# EAGLE schematic Central Board (EAGLE 8.5.1)

## Sheet 1 of 2
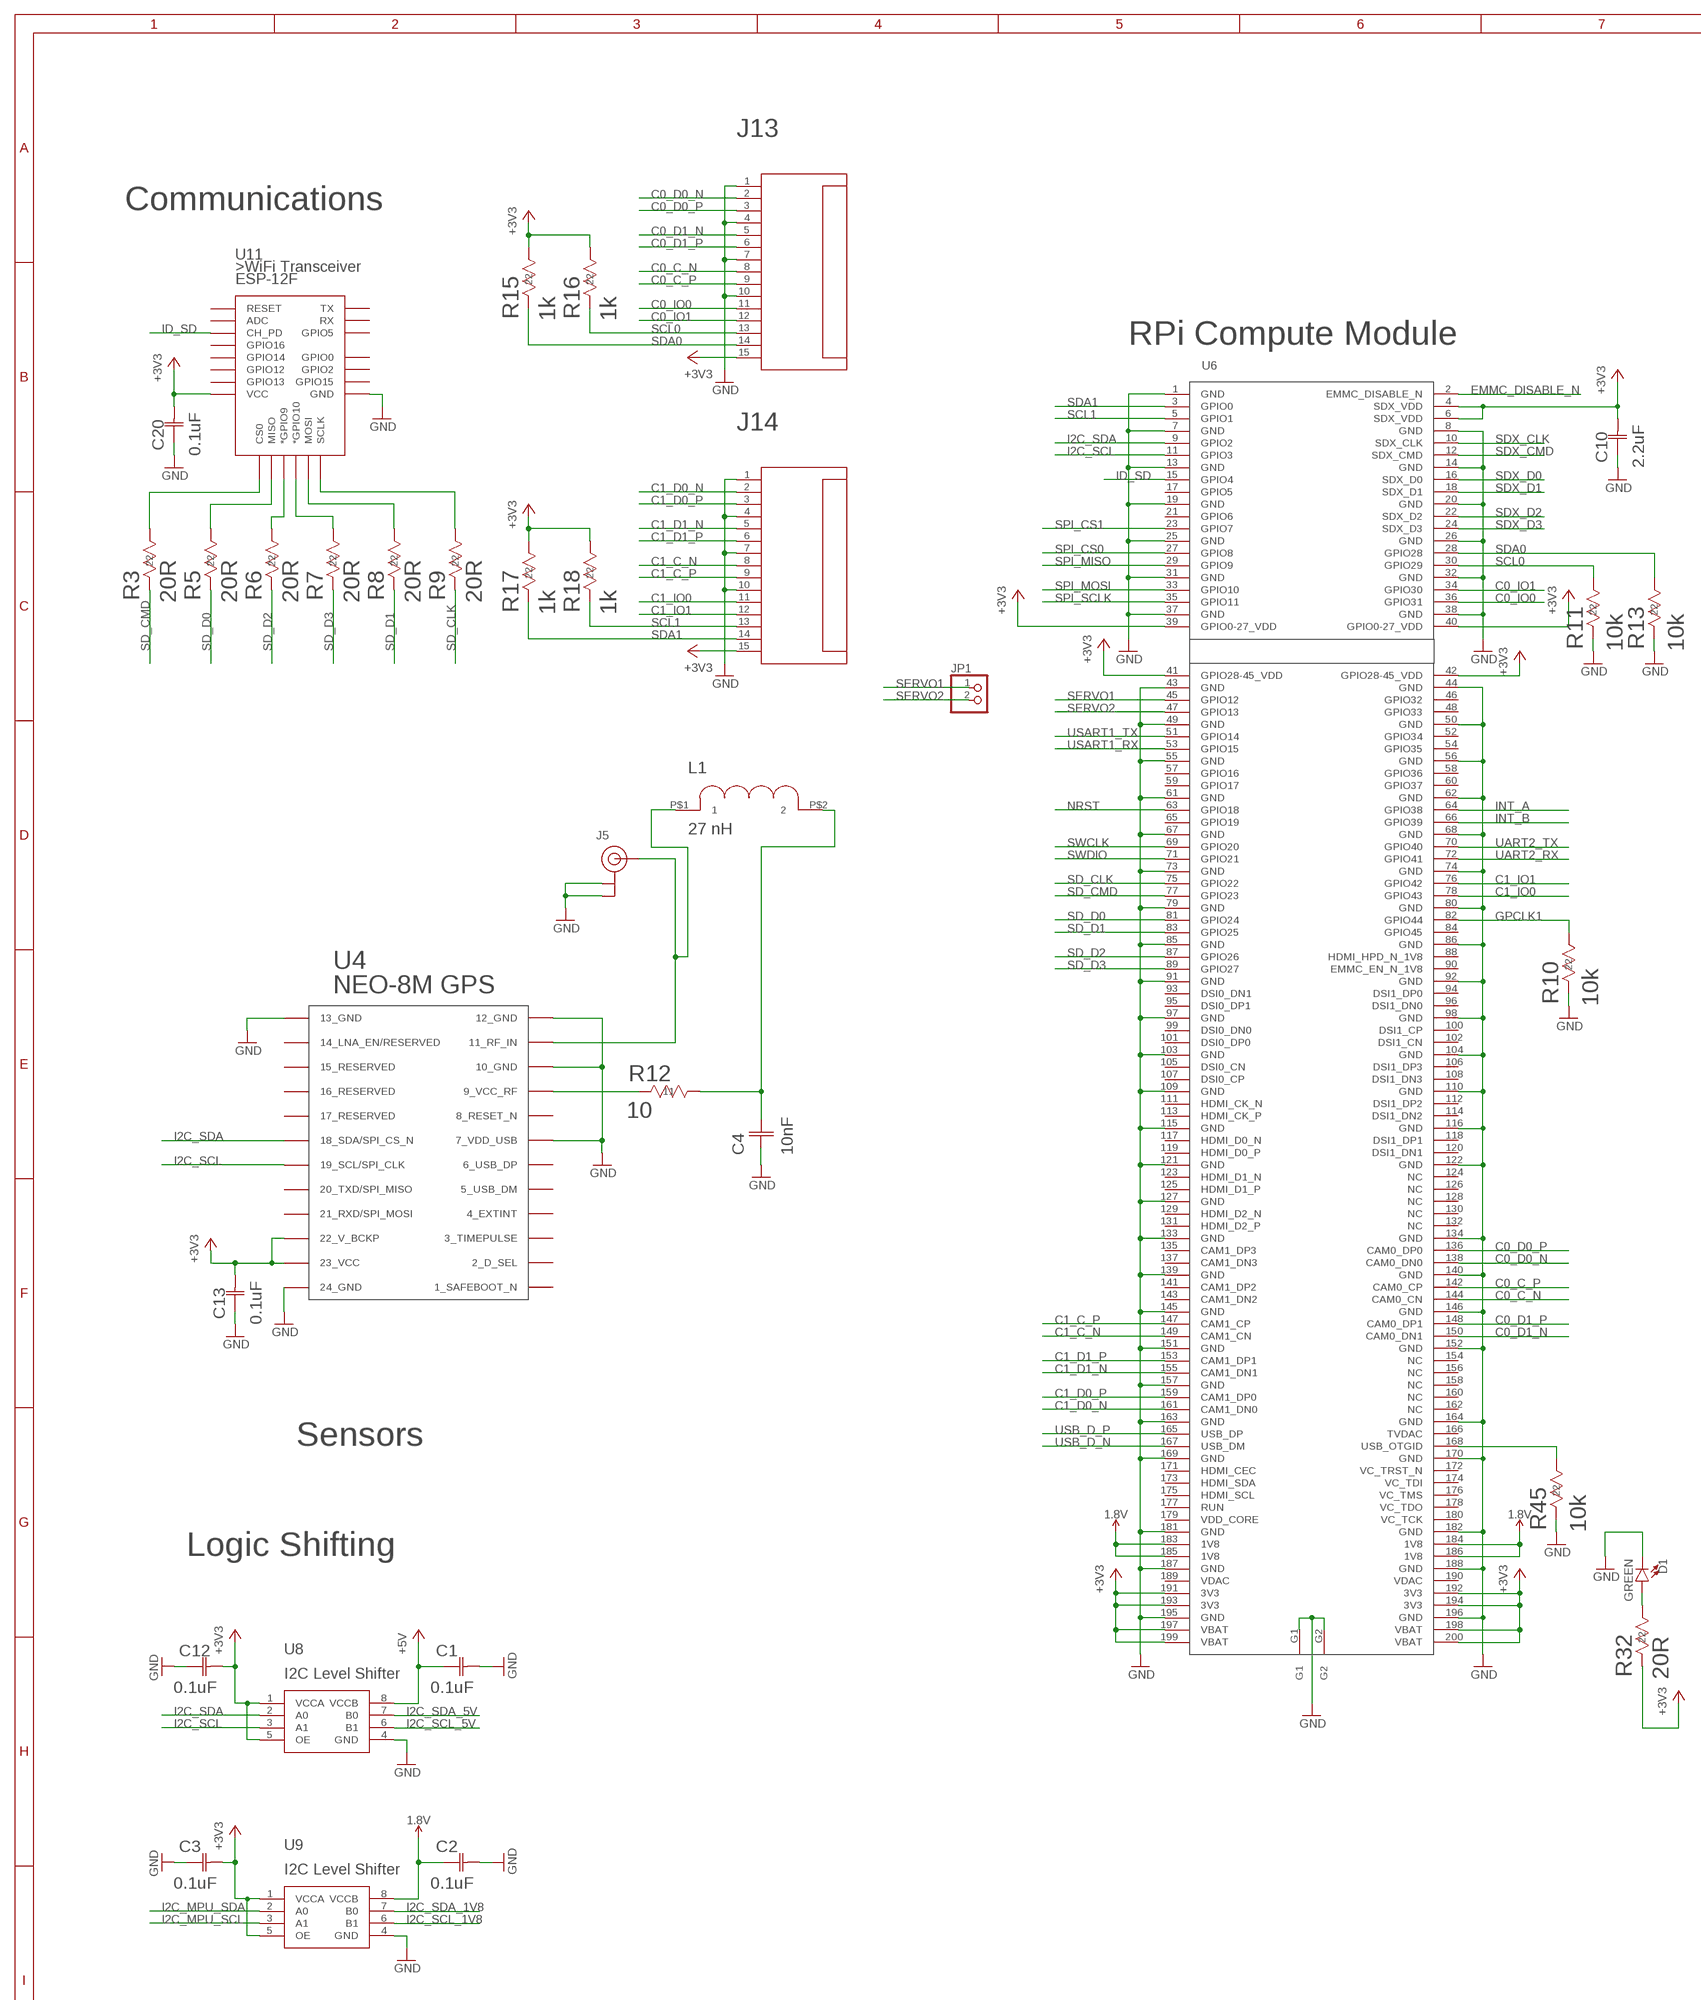
[diagram p0: schematic, sheet 1, part 1 of 2]
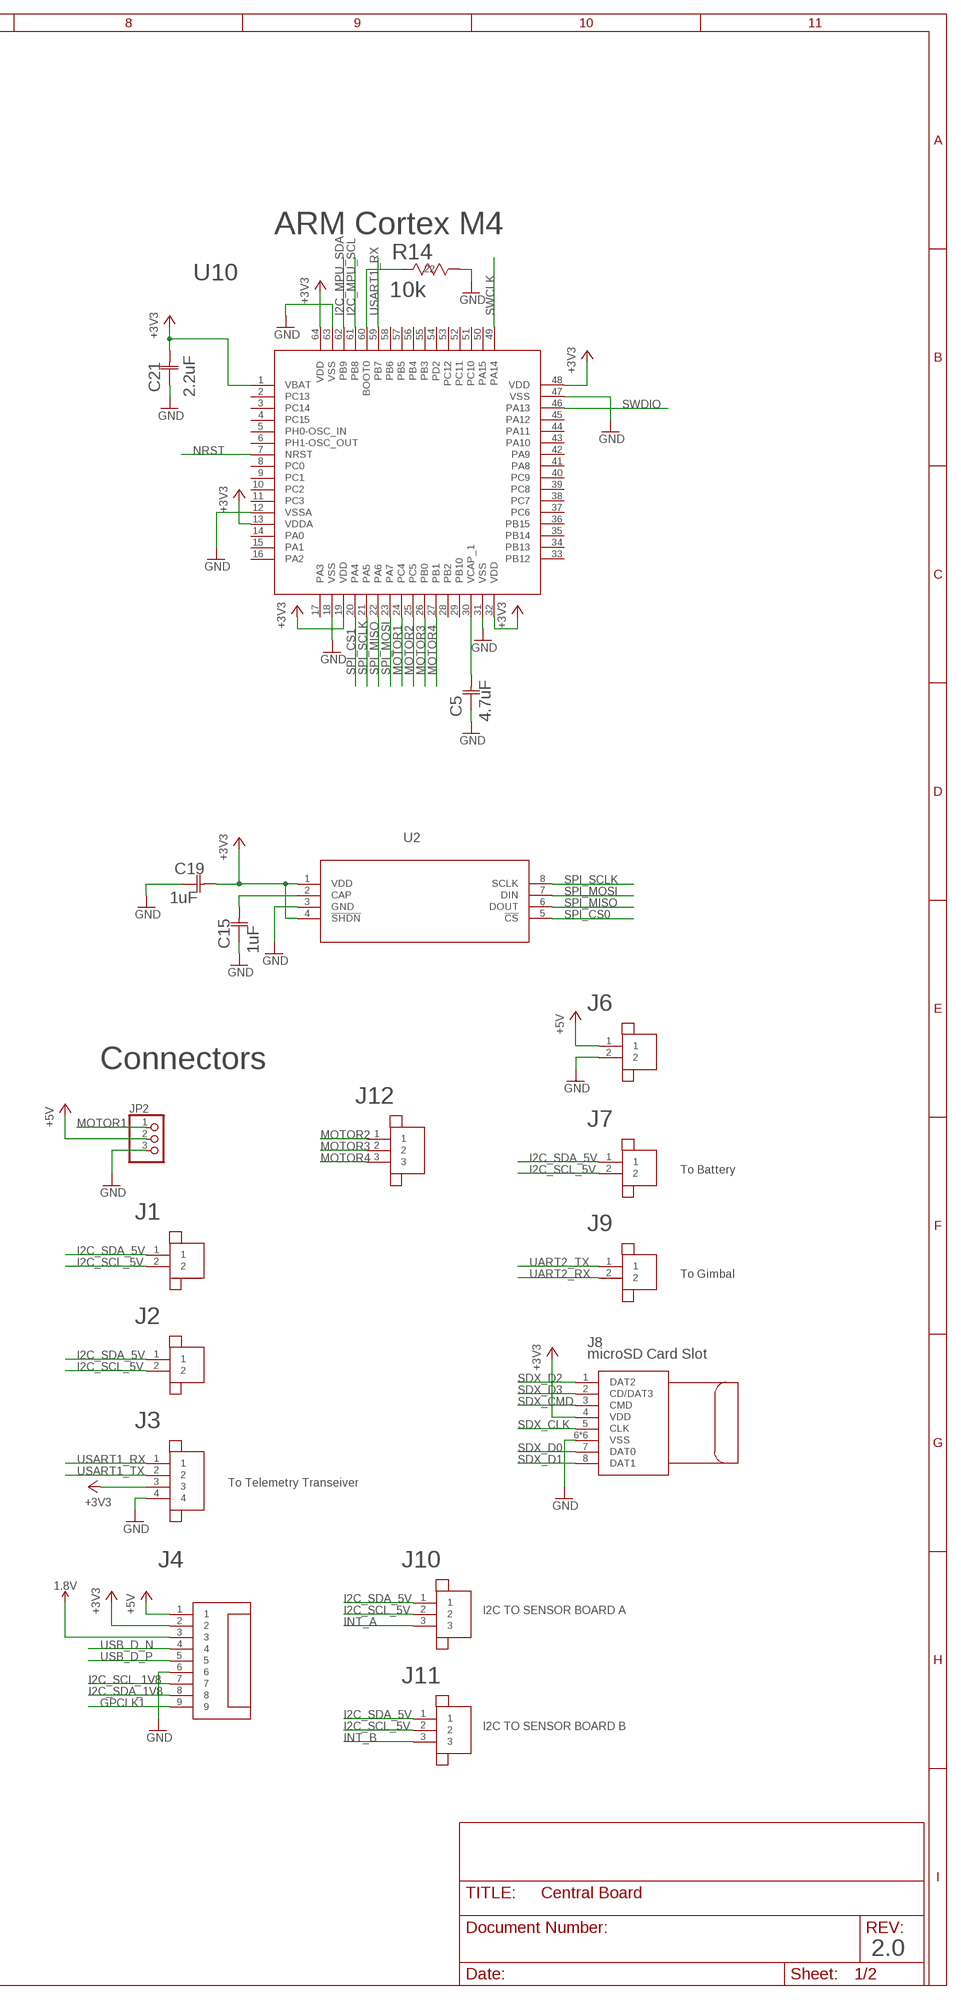
[diagram p1: schematic, sheet 1, part 2 of 2]

### Parts
C1  0.1uF  08055C104KAT2A  [0805]
C2  0.1uF  08055C104KAT2A  [0805]
C3  0.1uF  08055C104KAT2A  [0805]
C4  10nF  10NF_CAPACITOR  [0603_CAPACITOR]
C5  4.7uF  06036D475KAT2A0603-M  [0603-M]
C10  2.2uF  GRM188R61C225KE15JG-188-M  [G-188-M]
C12  0.1uF  08055C104KAT2A  [0805]
C13  0.1uF  08055C104KAT2A  [0805]
C15  1uF  CC0805KKX7R7BB105  [YAG_CC0805]
C19  1uF  CC0805KKX7R7BB105  [YAG_CC0805]
C20  0.1uF  08055C104KAT2A  [0805]
C21  2.2uF  GRM188R61C225KE15JG-188-M  [G-188-M]
D1  GREEN  LED-GREEN0603  [LED-0603]
J1  JST_SH_2POS  [JST_SH_2POS]
J2  JST_SH_2POS  [JST_SH_2POS]
J3  JST_SH_4POS  [JST_SH_4POS]
J4  9POS_FFC_CONNECTOR  [9POS_FFC_CONNECTOR]
J5  U.FL  [U.FL]
J6  JST_SH_2POS  [JST_SH_2POS]
J7  JST_SH_2POS  [JST_SH_2POS]
J8  MICROSD  [MICROSD]
J9  JST_SH_2POS  [JST_SH_2POS]
J10  JST_SH_3POS  [JST_SH_3POS]
J11  JST_SH_3POS  [JST_SH_3POS]
J12  JST_SH_3POS  [JST_SH_3POS]
J13  0526101572_15ZIF_CONNECTOR  [15POS_FFC_CONNECTOR]
J14  0526101572_15ZIF_CONNECTOR  [15POS_FFC_CONNECTOR]
JP1  PINHD-1X2  [1X02]
JP2  PINHD-1X3  [1X03]
L1  27 nH  27NH_INDUCTOR  [0402_INDUCTOR]
R3  20R  RC0603JR-0720RLRC0603N-M  [RC0603N-M]
R5  20R  RC0603JR-0720RLRC0603N-M  [RC0603N-M]
R6  20R  RC0603JR-0720RLRC0603N-M  [RC0603N-M]
R7  20R  RC0603JR-0720RLRC0603N-M  [RC0603N-M]
R8  20R  RC0603JR-0720RLRC0603N-M  [RC0603N-M]
R9  20R  RC0603JR-0720RLRC0603N-M  [RC0603N-M]
R10  10k  ERA-6AEB103V  [RC0805N]
R11  10k  ERA-6AEB103V  [RC0805N]
R12  10  RNCP0805FTD10R0STA_RNCP0805-M  [STA_RNCP0805-M]
R13  10k  ERA-6AEB103V  [RC0805N]
R14  10k  ERA-6AEB103V  [RC0805N]
R15  1k  RC0603JR-071KLRC0603N-M  [RC0603N-M]
R16  1k  RC0603JR-071KLRC0603N-M  [RC0603N-M]
R17  1k  RC0603JR-071KLRC0603N-M  [RC0603N-M]
R18  1k  RC0603JR-071KLRC0603N-M  [RC0603N-M]
R32  20R  RC0603JR-0720RLRC0603N-M  [RC0603N-M]
R45  10k  ERA-6AEB103V  [RC0805N]
U2  MPL115A1LGA8-M  [LGA8-M]
U4  NEO-M8  [NEO-M8]
U6  COMPUTE_MODULE  [SO-DIMM]
U8  FXMAR2102  [8-UMLP]
U9  FXMAR2102  [8-UMLP]
U10  STM32F446  [LQFP64]
U11  ESP12ESMD  [ESP12E-SMD]

### Nets
1.8V: C2.1 J4.3 U6.183(1V8) U6.184(1V8) U6.185(1V8) U6.186(1V8) U9.8(VCCB) ; also sheet 2
+3V3: C3.2 C10.2 C12.2 C13.2 C19.2 C20.2 C21.2 J3.3 J4.2 J8.4(VDD) J13.15 J14.15 R15.1 R16.1 R17.1 R18.1 R32.2 U2.1(VDD) U2.4(!SHDN) U4.22(22_V_BCKP) U4.23(23_VCC) U6.4(SDX_VDD) U6.6(SDX_VDD) U6.39(GPIO0-27_VDD) U6.40(GPIO0-27_VDD) U6.41(GPIO28-45_VDD) U6.42(GPIO28-45_VDD) U6.191(3V3) U6.192(3V3) U6.193(3V3) U6.194(3V3) U6.197(VBAT) U6.198(VBAT) U6.199(VBAT) U6.200(VBAT) U8.1(VCCA) U8.5(OE) U9.1(VCCA) U9.5(OE) U10.1(VBAT) U10.13(VDDA) U10.19(VDD) U10.32(VDD) U10.48(VDD) U10.64(VDD) U11.VCC ; also sheet 2
+5V: C1.1 J4.1 J6.1 JP2.2 U8.8(VCCB) ; also sheet 2
C0_C_N: J13.8 U6.144(CAM0_CN)
C0_C_P: J13.9 U6.142(CAM0_CP)
C0_D0_N: J13.2 U6.138(CAM0_DN0)
C0_D0_P: J13.3 U6.136(CAM0_DP0)
C0_D1_N: J13.5 U6.150(CAM0_DN1)
C0_D1_P: J13.6 U6.148(CAM0_DP1)
C0_IO0: J13.11 U6.36(GPIO31)
C0_IO1: J13.12 U6.34(GPIO30)
C1_C_N: J14.8 U6.149(CAM1_CN)
C1_C_P: J14.9 U6.147(CAM1_CP)
C1_D0_N: J14.2 U6.161(CAM1_DN0)
C1_D0_P: J14.3 U6.159(CAM1_DP0)
C1_D1_N: J14.5 U6.155(CAM1_DN1)
C1_D1_P: J14.6 U6.153(CAM1_DP1)
C1_IO0: J14.11 U6.78(GPIO43)
C1_IO1: J14.12 U6.76(GPIO42)
EMMC_DISABLE_N: U6.2(EMMC_DISABLE_N)
GND: C1.2 C2.2 C3.1 C4.1 C5.1 C10.1 C12.1 C13.1 C15.1 C19.1 C20.1 C21.1 D1.C J3.4 J4.6 J5.P$1(GND) J5.P$2(GND) J6.2 J8.6(VSS) J8.9(VSS) J8.10(VSS) J8.11(VSS) J8.12(VSS) J8.13(VSS) J13.1 J13.4 J13.7 J13.10 J14.1 J14.4 J14.7 J14.10 JP2.3 R10.2 R11.2 R13.2 R14.1 R45.2 U2.3(GND) U4.7(7_VDD_USB) U4.10(10_GND) U4.12(12_GND) U4.13(13_GND) U4.24(24_GND) U6.1(GND) U6.7(GND) U6.8(GND) U6.13(GND) U6.14(GND) U6.19(GND) U6.20(GND) U6.25(GND) U6.26(GND) U6.31(GND) U6.32(GND) U6.37(GND) U6.38(GND) U6.43(GND) U6.44(GND) U6.49(GND) U6.50(GND) U6.55(GND) U6.56(GND) U6.61(GND) U6.62(GND) U6.67(GND) U6.68(GND) U6.73(GND) U6.74(GND) U6.79(GND) U6.80(GND) U6.85(GND) U6.86(GND) U6.91(GND) U6.92(GND) U6.97(GND) U6.98(GND) U6.103(GND) U6.104(GND) U6.109(GND) U6.110(GND) U6.115(GND) U6.116(GND) U6.121(GND) U6.122(GND) U6.127(GND) U6.133(GND) U6.134(GND) U6.139(GND) U6.140(GND) U6.145(GND) U6.146(GND) U6.151(GND) U6.152(GND) U6.157(GND) U6.163(GND) U6.164(GND) U6.169(GND) U6.170(GND) U6.181(GND) U6.182(GND) U6.187(GND) U6.188(GND) U6.195(GND) U6.196(GND) U6.G1 U6.G2 U8.4(GND) U9.4(GND) U10.12(VSSA) U10.18(VSS) U10.31(VSS) U10.47(VSS) U10.63(VSS) U11.GND ; also sheet 2
GPCLK1: J4.9 R10.1 U6.82(GPIO44)
I2C_MPU_SCL: U9.3(A1) U10.61(PB8)
I2C_MPU_SDA: U9.2(A0) U10.62(PB9)
I2C_SCL: U4.19(19_SCL/SPI_CLK) U6.11(GPIO3) U8.3(A1)
I2C_SCL_1V8: J4.7 U9.6(B1)
I2C_SCL_5V: J1.2 J2.2 J7.2 J10.2 J11.2 U8.6(B1)
I2C_SDA: U4.18(18_SDA/SPI_CS_N) U6.9(GPIO2) U8.2(A0)
I2C_SDA_1V8: J4.8 U9.7(B0)
I2C_SDA_5V: J1.1 J2.1 J7.1 J10.1 J11.1 U8.7(B0)
ID_SD: U6.15(GPIO4) U11.CH_PD
INT_A: J10.3 U6.64(GPIO38)
INT_B: J11.3 U6.66(GPIO39)
MOTOR1: JP2.1 U10.24(PC4)
MOTOR2: J12.1 U10.25(PC5)
MOTOR3: J12.2 U10.26(PB0)
MOTOR4: J12.3 U10.27(PB1)
N$1: J5.P$3(SIGNAL) L1.P$1 U4.11(11_RF_IN)
N$4: D1.A R32.1
N$7: R3.1 U11.CS0
N$8: R5.1 U11.MISO
N$9: R6.1 U11.GPIO9(*GPIO9)
N$10: R7.1 U11.GPIO10(*GPIO10)
N$11: C5.2 U10.30(VCAP_1)
N$12: C15.2 U2.2(CAP)
N$13: R12.1 U4.9(9_VCC_RF)
N$14: R8.1 U11.MOSI
N$15: R9.1 U11.SCLK
N$16: R14.2 U10.60(BOOT0)
N$26: C4.2 L1.P$2 R12.2
N$53: R45.1 U6.168(USB_OTGID)
NRST: U6.63(GPIO18) U10.7(NRST)
SCL0: J13.13 R11.1 R16.2 U6.30(GPIO29)
SCL1: J14.13 R18.2 U6.5(GPIO1)
SD_CLK: R9.2 U6.75(GPIO22)
SD_CMD: R3.2 U6.77(GPIO23)
SD_D0: R5.2 U6.81(GPIO24)
SD_D1: R8.2 U6.83(GPIO25)
SD_D2: R6.2 U6.87(GPIO26)
SD_D3: R7.2 U6.89(GPIO27)
SDA0: J13.14 R13.1 R15.2 U6.28(GPIO28)
SDA1: J14.14 R17.2 U6.3(GPIO0)
SDX_CLK: J8.5(CLK) U6.10(SDX_CLK)
SDX_CMD: J8.3(CMD) U6.12(SDX_CMD)
SDX_D0: J8.7(DAT0) U6.16(SDX_D0)
SDX_D1: J8.8(DAT1) U6.18(SDX_D1)
SDX_D2: J8.1(DAT2) U6.22(SDX_D2)
SDX_D3: J8.2(CD/DAT3) U6.24(SDX_D3)
SERVO1: JP1.1 U6.45(GPIO12)
SERVO2: JP1.2 U6.47(GPIO13)
SPI_CS0: U2.5(!CS) U6.27(GPIO8)
SPI_CS1: U6.23(GPIO7) U10.20(PA4)
SPI_MISO: U2.6(DOUT) U6.29(GPIO9) U10.22(PA6)
SPI_MOSI: U2.7(DIN) U6.33(GPIO10) U10.23(PA7)
SPI_SCLK: U2.8(SCLK) U6.35(GPIO11) U10.21(PA5)
SWCLK: U6.69(GPIO20) U10.49(PA14)
SWDIO: U6.71(GPIO21) U10.46(PA13)
UART2_RX: J9.2 U6.72(GPIO41)
UART2_TX: J9.1 U6.70(GPIO40)
USART1_RX: J3.1 U6.53(GPIO15) U10.59(PB7)
USART1_TX: J3.2 U6.51(GPIO14)
USB_D_N: J4.4 U6.167(USB_DM)
USB_D_P: J4.5 U6.165(USB_DP)
Unconnected: U4.1(1_SAFEBOOT_N) U4.2(2_D_SEL) U4.3(3_TIMEPULSE) U4.4(4_EXTINT) U4.5(5_USB_DM) U4.6(6_USB_DP) U4.8(8_RESET_N) U4.14(14_LNA_EN/RESERVED) U4.15(15_RESERVED) U4.16(16_RESERVED) U4.17(17_RESERVED) U4.20(20_TXD/SPI_MISO) U4.21(21_RXD/SPI_MOSI) U6.17(GPIO5) U6.21(GPIO6) U6.46(GPIO32) U6.48(GPIO33) U6.52(GPIO34) U6.54(GPIO35) U6.57(GPIO16) U6.58(GPIO36) U6.59(GPIO17) U6.60(GPIO37) U6.65(GPIO19) U6.84(GPIO45) U6.88(HDMI_HPD_N_1V8) U6.90(EMMC_EN_N_1V8) U6.93(DSI0_DN1) U6.94(DSI1_DP0) U6.95(DSI0_DP1) U6.96(DSI1_DN0) U6.99(DSI0_DN0) U6.100(DSI1_CP) U6.101(DSI0_DP0) U6.102(DSI1_CN) U6.105(DSI0_CN) U6.106(DSI1_DP3) U6.107(DSI0_CP) U6.108(DSI1_DN3) U6.111(HDMI_CK_N) U6.112(DSI1_DP2) U6.113(HDMI_CK_P) U6.114(DSI1_DN2) U6.117(HDMI_D0_N) U6.118(DSI1_DP1) U6.119(HDMI_D0_P) U6.120(DSI1_DN1) U6.123(HDMI_D1_N) U6.124(NC) U6.125(HDMI_D1_P) U6.126(NC) U6.128(NC) U6.129(HDMI_D2_N) U6.130(NC) U6.131(HDMI_D2_P) U6.132(NC) U6.135(CAM1_DP3) U6.137(CAM1_DN3) U6.141(CAM1_DP2) U6.143(CAM1_DN2) U6.154(NC) U6.156(NC) U6.158(NC) U6.160(NC) U6.162(NC) U6.166(TVDAC) U6.171(HDMI_CEC) U6.172(VC_TRST_N) U6.173(HDMI_SDA) U6.174(VC_TDI) U6.175(HDMI_SCL) U6.176(VC_TMS) U6.177(RUN) U6.178(VC_TDO) U6.179(VDD_CORE) U6.180(VC_TCK) U6.189(VDAC) U6.190(VDAC) U10.2(PC13) U10.3(PC14) U10.4(PC15) U10.5(PH0-OSC_IN) U10.6(PH1-OSC_OUT) U10.8(PC0) U10.9(PC1) U10.10(PC2) U10.11(PC3) U10.14(PA0) U10.15(PA1) U10.16(PA2) U10.17(PA3) U10.28(PB2) U10.29(PB10) U10.33(PB12) U10.34(PB13) U10.35(PB14) U10.36(PB15) U10.37(PC6) U10.38(PC7) U10.39(PC8) U10.40(PC9) U10.41(PA8) U10.42(PA9) U10.43(PA10) U10.44(PA11) U10.45(PA12) U10.50(PA15) U10.51(PC10) U10.52(PC11) U10.53(PC12) U10.54(PD2) U10.55(PB3) U10.56(PB4) U10.57(PB5) U10.58(PB6) U11.ADC U11.GPIO0 U11.GPIO2 U11.GPIO5 U11.GPIO12 U11.GPIO13 U11.GPIO14 U11.GPIO15 U11.GPIO16 U11.RESET U11.RXD0(RX) U11.TXD0(TX)

### Notes on the sheet
- Communications
- ARM Cortex M4
- RPi Compute Module
- Connectors
- To Battery
- To Gimbal
- Sensors
- Logic Shifting
- To Telemetry Transeiver
- I2C TO SENSOR BOARD A
- I2C TO SENSOR BOARD B
- 2.0

## Sheet 2 of 2
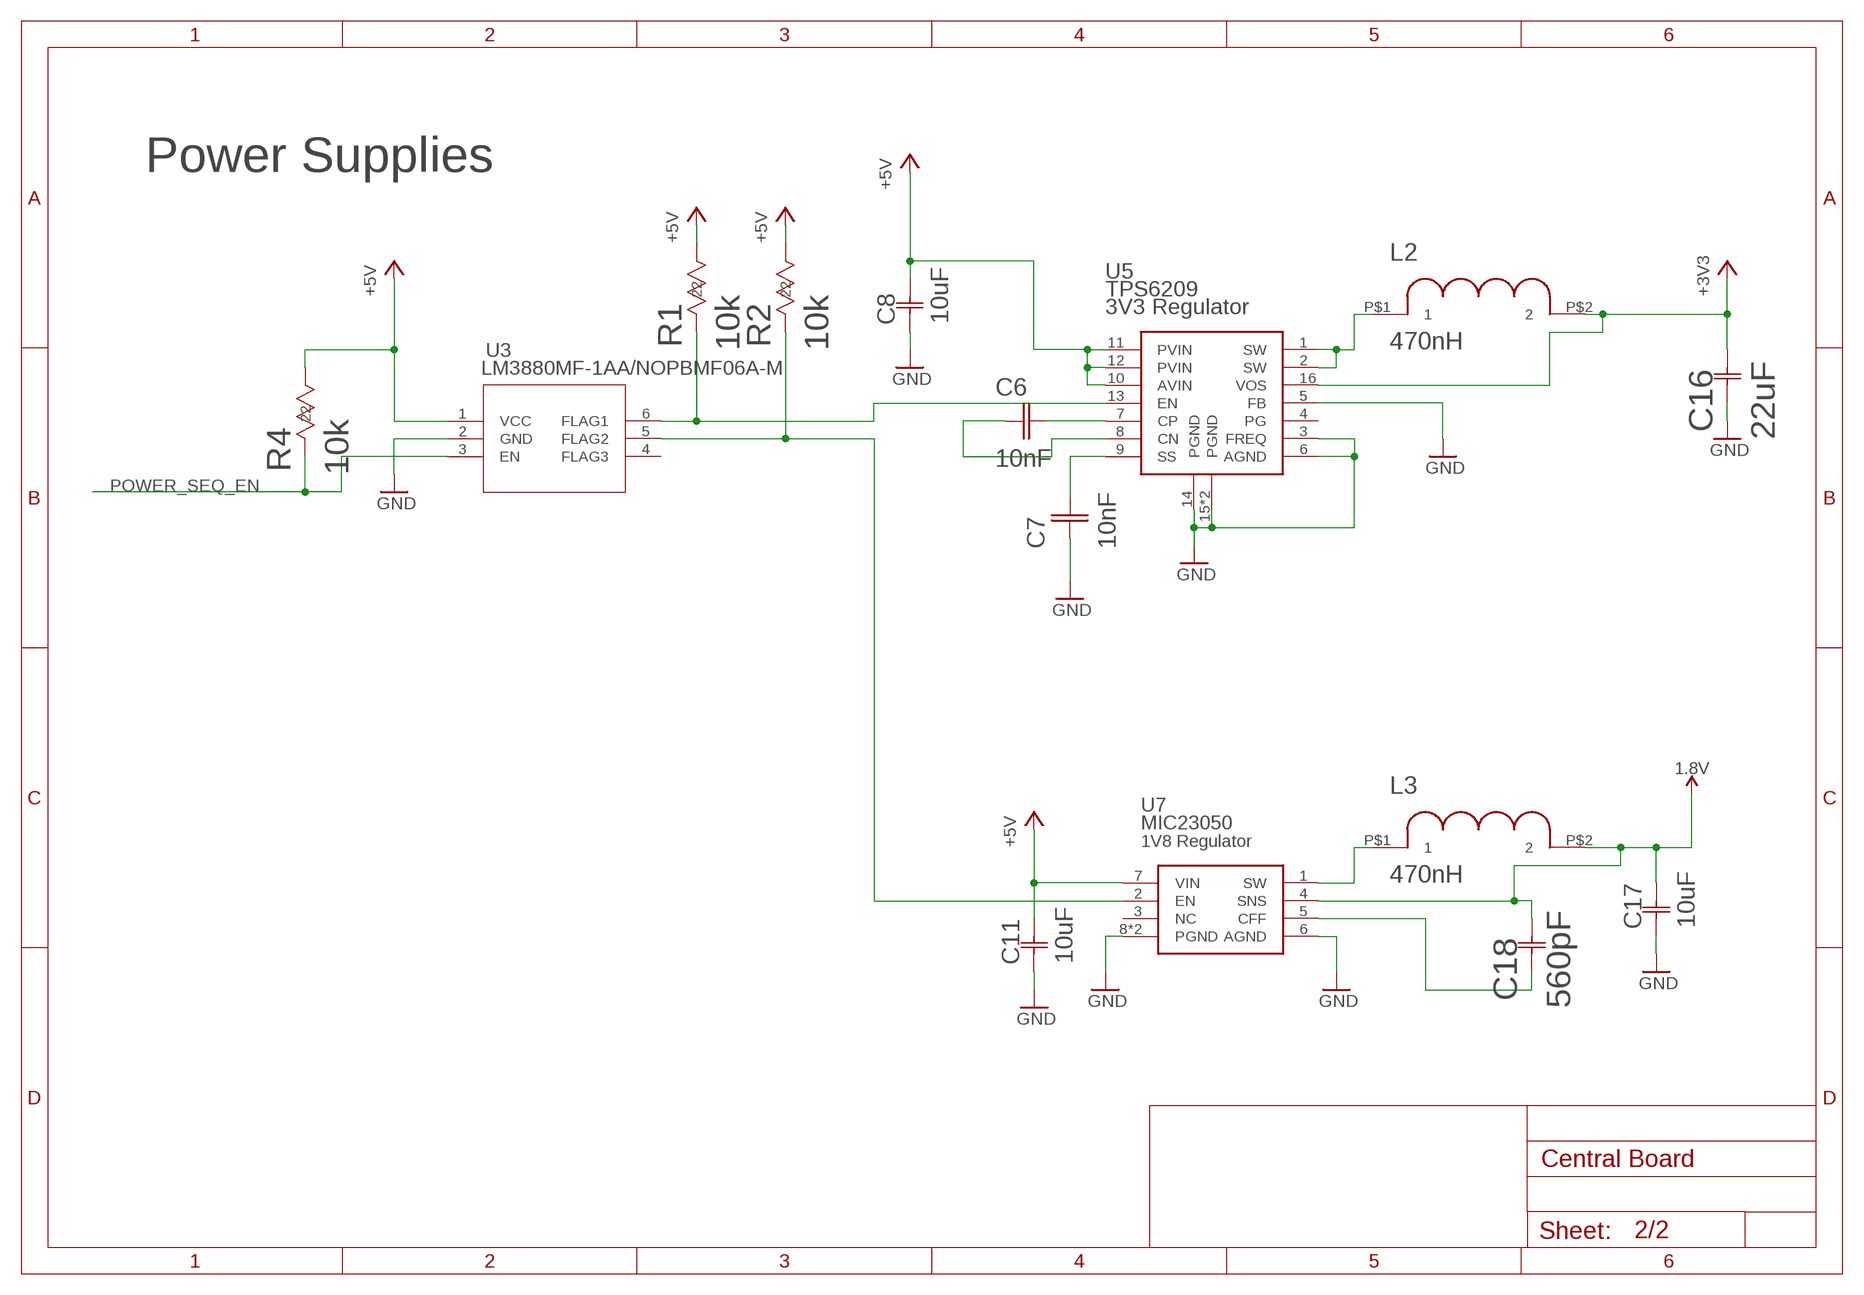
[diagram p2: schematic, sheet 2]

### Parts
C6  10nF  10NF_CAPACITOR  [0603_CAPACITOR]
C7  10nF  10NF_CAPACITOR  [0603_CAPACITOR]
C8  10uF  GRM21BR60J106ME19L  [G-21]
C11  10uF  GRM21BR60J106ME19L  [G-21]
C16  22uF  GRM21BR60J226ME39L  [G-21]
C17  10uF  GRM21BR60J106ME19L  [G-21]
C18  560pF  CC0402KRX7R9BB561CC0402N-M  [CC0402N-M]
L2  470nH  470NH_INDUCTOR  [1008_INDUCTOR]
L3  470nH  470NH_INDUCTOR  [1008_INDUCTOR]
R1  10k  ERA-6AEB103V  [RC0805N]
R2  10k  ERA-6AEB103V  [RC0805N]
R4  10k  ERA-6AEB103V  [RC0805N]
U3  LM3880MF-1AA/NOPBMF06A-M  [MF06A-M]
U5  TPS6209  [VQFN16]
U7  MIC23050  [MLF(ML)_8PIN]

### Nets
1.8V: C17.2 C18.2 L3.P$2 U7.4(SNS) ; also sheet 1
+3V3: C16.2 L2.P$2 U5.16(VOS) ; also sheet 1
+5V: C8.2 C11.2 R1.1 R2.1 R4.1 U3.1(VCC) U5.10(AVIN) U5.11(PVIN) U5.12(PVIN) U7.7(VIN) ; also sheet 1
GND: C7.1 C8.1 C11.1 C16.1 C17.1 U3.2(GND) U5.3(FREQ) U5.5(FB) U5.6(AGND) U5.14(PGND) U5.15(PGND) U5.17(PGND) U7.6(AGND) U7.8(PGND) U7.EP(PGND) ; also sheet 1
N$2: C6.2 U5.7(CP)
N$3: C6.1 U5.8(CN)
N$5: R1.2 U3.6(FLAG1) U5.13(EN)
N$6: R2.2 U3.5(FLAG2) U7.2(EN)
N$29: C7.2 U5.9(SS)
N$30: L2.P$1 U5.1(SW) U5.2(SW)
N$32: L3.P$1 U7.1(SW)
N$48: C18.1 U7.5(CFF)
POWER_SEQ_EN: R4.2 U3.3(EN)
Unconnected: U3.4(FLAG3) U5.4(PG) U7.3(NC)

### Notes on the sheet
- Power Supplies

## Library data of the parts
C1-C3 C12 C13 C20 = 0.1uF X7R Ceramic Capacitor:08055C104KAT2A; COPYRIGHT: Copyright C 2015 Accelerated Designs. All rights reserved; MANUFACTURER_PART_NUMBER: 08055C104KAT2A; VENDOR: Vendor
C4 C6 C7 = thanics_robotics:10NF_CAPACITOR
C5 = 4.7uF-capacitor:06036D475KAT2A; MANUFACTURER_PART_NUMBER: 06036D475KAT2A; VENDOR: AVX Corporation
C8 C11 C17 = 10uF X5R Ceramic Capacitor:GRM21BR60J106ME19L; COPYRIGHT: Copyright C 2015 Accelerated Designs. All rights reserved; MANUFACTURER_PART_NUMBER: GRM21BR60J106ME19L; VENDOR: Vendor
C10 C21 = 2.2uF X5R Capacitor:GRM188R61C225KE15J; COPYRIGHT: Copyright C 2015 Accelerated Designs. All rights reserved; MANUFACTURER_PART_NUMBER: GRM188R61C225KE15J; VENDOR: Vendor
C15 C19 = 1uF X7R Ceramic Capacitor:CC0805KKX7R7BB105; COPYRIGHT: Copyright C 2015 Accelerated Designs. All rights reserved; MANUFACTURER_PART_NUMBER: CC0805KKX7R7BB105; VENDOR: Vendor
C16 = 22uF X5R Ceramic Capacitor:GRM21BR60J226ME39L; COPYRIGHT: Copyright C 2015 Accelerated Designs. All rights reserved; MANUFACTURER_PART_NUMBER: GRM21BR60J226ME39L; VENDOR: Vendor
C18 = 560pF-capacitor:CC0402KRX7R9BB561; MANUFACTURER_PART_NUMBER: CC0402KRX7R9BB561; VENDOR: Yageo
D1 = SparkFun-LED:LED-GREEN: Green SMD LED Used in manufacturing of various products at SparkFun Packages: 0603 - SMD 0603 package [Product Link] <http://www.futureelectronics.com/en/technologies/semiconductors/optoelectronics/leds/Pages/9894312-LTST-C190GKT.aspx?CrossPart=HSMG-C190&IM=0> LilyPad 1206 - SMD1206 LilyPad package [Product Link] <http://www.futureelectronics.com/en/Technologies/Product.aspx?ProductID=IN150NGHARVATEKCORPORATION2049943&IM=0> 1206 - SMD1206 package [Product Link] <http://www.futureelectronics.com/en/technologies/semiconductors/optoelectronics/leds/Pages/8315665-LTST-C150KGKT.aspx?IM=0> 1206 Bottom Mount -SMD 1206 Bottom Mount [Product Link] <http://www.digikey.com/product-detail/en/lite-on-inc/LTST-C230KGKT/160-1456-1-ND/386854> SparkFun Products: Pro Mini 328 -5V <https://www.sparkfun.com/products/821> RedBoard <https://www.sparkfun.com/products/12757> MP3 Trigger <https://www.sparkfun.com/products/13720> Makey Makey <https://www.sparkfun.com/products/11076>; PROD_ID: DIO-00821
J1 J2 J6 J7 J9 = thanics_robotics:JST_SH_2POS
J3 = thanics_robotics:JST_SH_4POS
J4 = thanics_robotics:9POS_FFC_CONNECTOR
J5 = SparkFun-Connectors:U.FL: SMD Antenna Connector - U.FL 2mm height, 3.0mm x 3.0mm receptacle size. SparkFun Products: SparkFun WiFi Shield - ESP8266 <https://www.sparkfun.com/products/13287> SparkFun ESP8266 Thing <https://www.sparkfun.com/products/13231> SparkFun MiniGen - Pro Mini Signal Generator Shield <https://www.sparkfun.com/products/11420>; PROD_ID: CONN-09193; SF_ID: WRL-09144
J8 = thanics_robotics:MICROSD
J10-J12 = thanics_robotics:JST_SH_3POS
J13 J14 = thanics_robotics:0526101572_15ZIF_CONNECTOR
JP1 = pinhead:PINHD-1X2: PIN HEADER
JP2 = pinhead:PINHD-1X3: PIN HEADER
L1 = thanics_robotics:27NH_INDUCTOR
L2 L3 = thanics_robotics:470NH_INDUCTOR
R1 R2 R4 R10 R11 R13 R14 R45 = 10k-resistor:ERA-6AEB103V; CASE: 0805 2012 metric; COMPOSITION: Thin Film; COPYRIGHT: Copyright C 2015 Accelerated Designs. All rights reserved; DATASHEET: httpindustrial.panasonic.comwwwcgijvcr13pz.cgi?E+PZ+3+AOA0026+ERA6AEB103V+7+WW; DIGIKEYPARTNUMBER: P10KDATRND; HEIGHT: 0.024" 0.60mm; LEADSTYLE: Surface Mount SMD SMT; MANUFACTURER_PART_NUMBER: ERA6AEB103V; NUMBEROFTERMINATIONS: 2; PACKAGECASE: 0805 2012 Metric; PACKAGING: Tape &amp Reel TR; POWERWATTS: 0.125W 18W; QUANTITY_AVAILABLE: 225000; RESISTANCEINOHMS: 10.0K; RESISTANCEOHMS: 10K; SIZEDIMENSION: 0.079" L x 0.049" W 2.00mm x 1.25mm; TEMPERATURECOEFFICIENT: 25ppm°C; TOLERANCE: 0.1%; VENDOR: Panasonic; VOLTAGEWORKING: 100V
R3 R5-R9 R32 = 20-resistor:RC0603JR-0720RL; MANUFACTURER_PART_NUMBER: RC0603JR0720RL; VENDOR: Yageo
R12 = 10-resistor:RNCP0805FTD10R0; COPYRIGHT: Copyright C 2015 Accelerated Designs. All rights reserved; MANUFACTURER_PART_NUMBER: RNCP0805FTD10R0; VENDOR: Vendor
R15-R18 = 1k-resistor:RC0603JR-071KL; CASE: 0603 1608 metric; COMPOSITION: Thick Film; COPYRIGHT: Copyright C 2015 Accelerated Designs. All rights reserved; DATASHEET: httpwww.yageo.comdocumentsrecentPYuRC0603_51_RoHS_L_4.pdf; DESCRIPTION: RES 1.0K OHM 110W 5% 0603 SMD; DIGIKEYPARTNUMBER: 3111.0KGRTRND; HEIGHT: 0.022" 0.55mm; LEADSTYLE: Surface Mount SMD SMT; MANUFACTURER_PART_NUMBER: RC0603JR071KL; NEWARKPARTNUMBER: 14M7231; NUMBEROFTERMINATIONS: 2; PACKAGECASE: 0603 1608 Metric; PACKAGING: Tape &amp Reel TR; POWERWATTS: 0.1W 110W; QUANTITY_AVAILABLE: 0; RESISTANCEINOHMS: 1.00K; RESISTANCEOHMS: 1K; SIZEDIMENSION: 0.063" L x 0.031" W 1.60mm x 0.80mm; TEMPERATURECOEFFICIENT: 100ppm°C; TOLERANCE: 5%; VENDOR: Yageo; VOLTAGEWORKING: 50V
U2 = mpl115a1-barometer:MPL115A1; MANUFACTURER_PART_NUMBER: mpl115a1; VENDOR: Freescale
U3 = LM3880MF:LM3880MF-1AA/NOPB; MANUFACTURER_PART_NUMBER: lm3880mf1aaNOPB; VENDOR: National Semiconductor
U4 = ubloxLib:NEO-M8: u-blox NEO GNSS module
U5 = thanics_robotics:TPS6209
U6 = raspberrypi_cm:COMPUTE_MODULE: Raspberry Pi Compute Module www.hasseb.fi
U7 = thanics_robotics:MIC23050
U8 U9 = thanics_robotics:FXMAR2102
U10 = thanics_robotics:STM32F446
U11 = esp8266modules:ESP12E: ESP12E Module